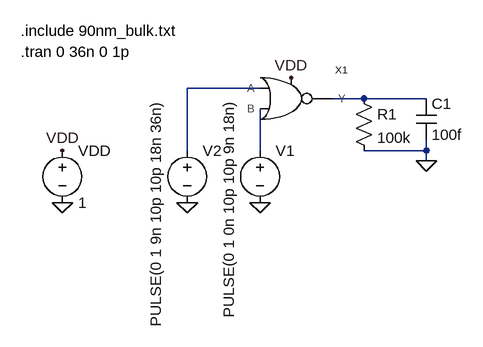
[diagram p0: schematic nortest.asc]
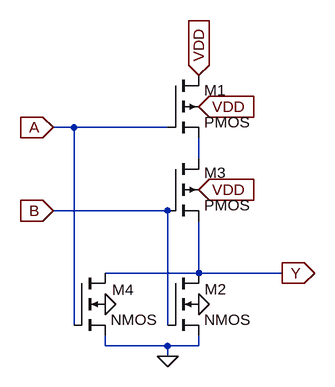
[diagram p1: sub-circuit nor.asc]
nortest.asc, the LTspice schematic file:
Version 4
SHEET 1 880 4068
WIRE -304 3472 -416 3472
WIRE -144 3488 -192 3488
WIRE -48 3488 -144 3488
WIRE -416 3568 -416 3472
WIRE -304 3568 -304 3504
WIRE -48 3568 -48 3552
WIRE -48 3568 -144 3568
WIRE -48 3584 -48 3568
FLAG -304 3648 0
FLAG -608 3648 0
FLAG -48 3584 0
FLAG -608 3568 VDD
FLAG -256 3456 VDD
FLAG -416 3648 0
SYMBOL voltage -304 3552 R0
WINDOW 3 -48 -64 VRight 2
WINDOW 123 0 0 Left 0
WINDOW 39 0 0 Left 0
SYMATTR Value PULSE(0 1 0n 10p 10p 9n 18n)
SYMATTR InstName V1
SYMBOL voltage -608 3552 R0
WINDOW 123 0 0 Left 0
WINDOW 39 0 0 Left 0
SYMATTR InstName VDD
SYMATTR Value 1
SYMBOL res -160 3472 R0
SYMATTR InstName R1
SYMATTR Value 100k
SYMBOL cap -64 3488 R0
SYMATTR InstName C1
SYMATTR Value 100f
SYMBOL voltage -416 3552 R0
WINDOW 3 -48 -64 VRight 2
WINDOW 123 0 0 Left 0
WINDOW 39 0 0 Left 0
SYMATTR Value PULSE(0 1 9n 10p 10p 18n 36n)
SYMATTR InstName V2
SYMBOL NOR -272 3488 R0
SYMATTR InstName X1
TEXT -672 3384 Left 2 !.include 90nm_bulk.txt
TEXT -672 3416 Left 2 !.tran 0 36n 0 1p

nor.asc, the sub-circuit schematic file:
Version 4
SHEET 1 880 856
WIRE 16 368 -16 368
WIRE 160 368 16 368
WIRE 208 416 208 384
WIRE 160 496 -16 496
WIRE 208 592 208 512
WIRE 208 592 64 592
WIRE 336 592 208 592
WIRE 16 672 16 368
WIRE 160 672 160 496
WIRE 64 704 64 688
WIRE 160 704 64 704
WIRE 208 704 208 688
WIRE 208 704 160 704
WIRE 160 720 160 704
FLAG 160 720 0
FLAG 208 640 0
FLAG 64 640 0
FLAG -16 368 A
IOPIN -16 368 In
FLAG -16 496 B
IOPIN -16 496 In
FLAG 208 464 VDD
IOPIN 208 464 In
FLAG 208 336 VDD
IOPIN 208 336 In
FLAG 208 288 VDD
IOPIN 208 288 In
FLAG 336 592 Y
IOPIN 336 592 Out
SYMBOL nmos4 160 592 R0
WINDOW 0 57 25 Left 2
SYMATTR InstName M2
SYMATTR Value2 l=90n w=200n
SYMBOL nmos4 16 592 R0
WINDOW 0 59 26 Left 2
SYMATTR InstName M4
SYMATTR Value2 l=90n w=200n
SYMBOL pmos4 160 288 R0
WINDOW 0 56 23 Left 2
SYMATTR InstName M1
SYMATTR Value2 l=90n w=400n
SYMBOL pmos4 160 416 R0
WINDOW 0 56 22 Left 2
SYMATTR InstName M3
SYMATTR Value2 l=90n w=400n

The netlist it stands for:
* nortest.asc
V1 N003 0 PULSE(0 1 0n 10p 10p 9n 18n)
VDD VDD 0 1
R1 N002 0 100k
C1 N002 0 100f
V2 N001 0 PULSE(0 1 9n 10p 10p 18n 36n)
XX1 N001 N003 N002 VDD nor

* block symbol definitions
.subckt nor A B Y VDD
M2 Y B 0 0 NMOS l=90n w=200n
M4 Y A 0 0 NMOS l=90n w=200n
M1 VDD A N001 VDD PMOS l=90n w=400n
M3 N001 B Y VDD PMOS l=90n w=400n
.ends nor

.model NMOS NMOS
.model PMOS PMOS
.lib standard.mos
.include 90nm_bulk.txt
.tran 0 36n 0 1p
.backanno
.end